# Altium schematic sheet Connector.SchDoc
size A3; SheetNumber: 4; SheetTotal: 5
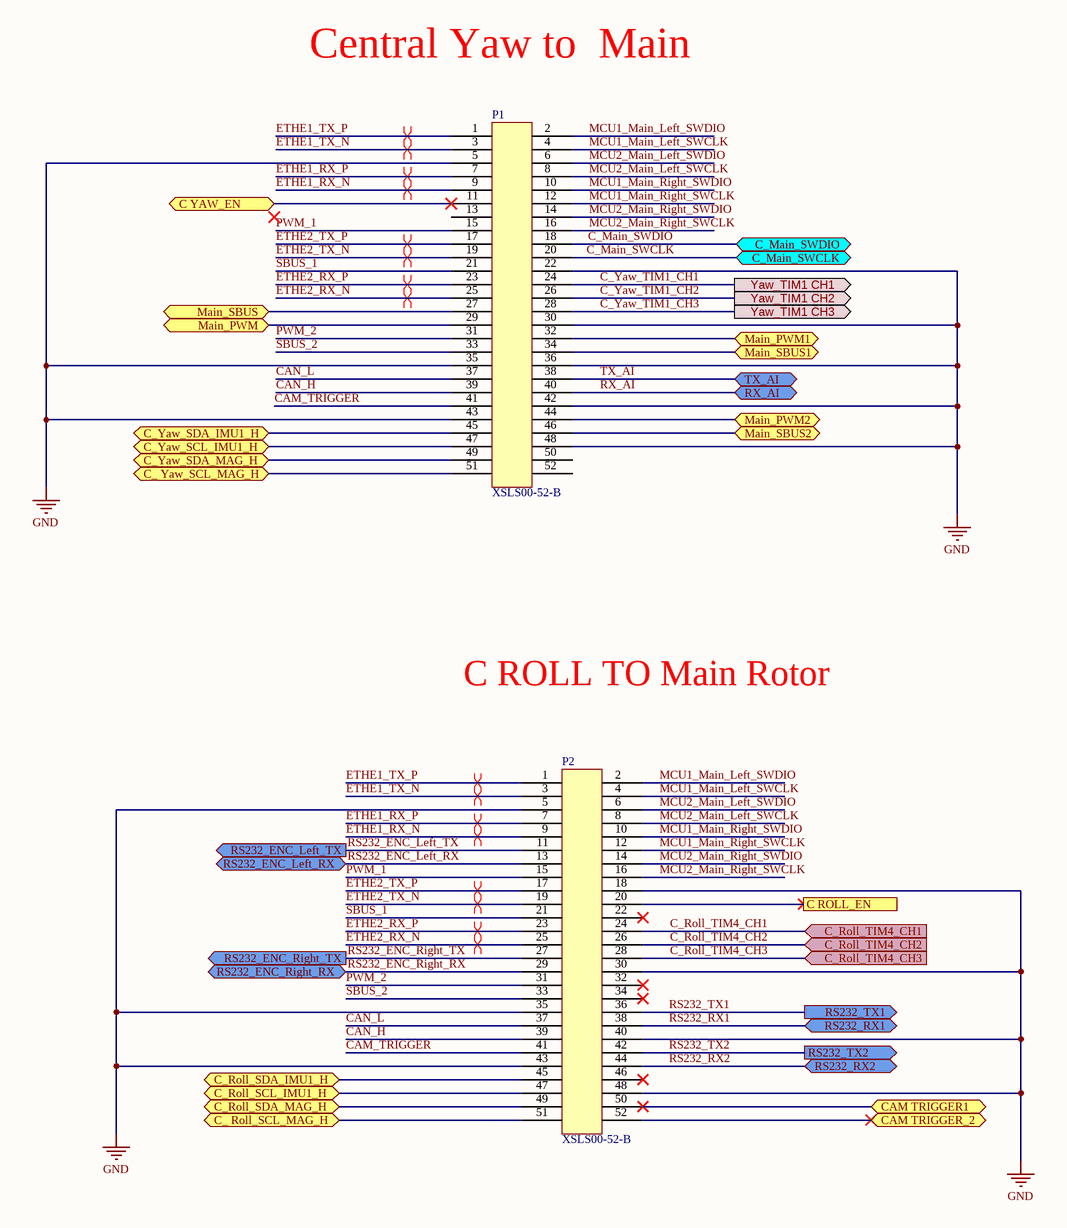
[diagram p0: Connector.SchDoc]

## Parts
P1  XSLS00-52-B  [XSXL52]
P2  XSLS00-52-B  [XSXL52]

## Ports
C ROLL_EN, C YAW_EN (bidir), C_ Roll_SCL_MAG_H (bidir), C_ Yaw_SCL_MAG_H (bidir), C_Main_SWCLK (bidir), C_Main_SWDIO (bidir), C_Roll_SCL_IMU1_H (bidir), C_Roll_SDA_IMU1_H (bidir), C_Roll_SDA_MAG_H (bidir), C_Roll_TIM4_CH1 (in), C_Roll_TIM4_CH2 (in), C_Roll_TIM4_CH3 (in), C_Yaw_SCL_IMU1_H (bidir), C_Yaw_SDA_IMU1_H (bidir), C_Yaw_SDA_MAG_H (bidir), CAM TRIGGER1 (bidir), CAM TRIGGER_2 (bidir), Main_PWM1 (bidir), Main_PWM2 (bidir), Main_PWM (bidir), Main_SBUS1 (bidir), Main_SBUS2 (bidir), Main_SBUS (bidir), RS232_ENC_Left_RX (bidir), RS232_ENC_Left_TX (out), RS232_ENC_Right_RX (bidir), RS232_ENC_Right_TX (out), RS232_RX1 (bidir), RS232_RX2 (bidir), RS232_TX1 (out), RS232_TX2 (out), RX_AI (bidir), TX_AI (bidir), Yaw_TIM1 CH1 (out), Yaw_TIM1 CH2 (out), Yaw_TIM1 CH3 (out)

## Nets
GND: P1.5 P1.22 P1.30 P1.35 P1.36 P1.42 P1.43 P1.48 P2.5 P2.18 P2.30 P2.35 P2.40 P2.43 P2.48
C ROLL_EN: P2.20 ; port C ROLL_EN
C YAW_EN: P1.11 ; port C YAW_EN
C_ Roll_SCL_MAG_H: P2.51 ; port C_ Roll_SCL_MAG_H
C_ Yaw_SCL_MAG_H: P1.51 ; port C_ Yaw_SCL_MAG_H
C_Main_SWCLK: P1.20 ; port C_Main_SWCLK
C_Main_SWDIO: P1.18 ; port C_Main_SWDIO
C_Roll_SCL_IMU1_H: P2.47 ; port C_Roll_SCL_IMU1_H
C_Roll_SDA_IMU1_H: P2.45 ; port C_Roll_SDA_IMU1_H
C_Roll_SDA_MAG_H: P2.49 ; port C_Roll_SDA_MAG_H
C_Roll_TIM4_CH1: P2.24 ; port C_Roll_TIM4_CH1
C_Roll_TIM4_CH2: P2.26 ; port C_Roll_TIM4_CH2
C_Roll_TIM4_CH3: P2.28 ; port C_Roll_TIM4_CH3
C_Yaw_SCL_IMU1_H: P1.47 ; port C_Yaw_SCL_IMU1_H
C_Yaw_SDA_IMU1_H: P1.45 ; port C_Yaw_SDA_IMU1_H
C_Yaw_SDA_MAG_H: P1.49 ; port C_Yaw_SDA_MAG_H
C_Yaw_TIM1_CH1: P1.24 ; port Yaw_TIM1 CH1
C_Yaw_TIM1_CH2: P1.26 ; port Yaw_TIM1 CH2
C_Yaw_TIM1_CH3: P1.28 ; port Yaw_TIM1 CH3
CAM TRIGGER1: P2.50 ; port CAM TRIGGER1
CAM TRIGGER_2: P2.52 ; port CAM TRIGGER_2
CAM_TRIGGER: P1.41 P2.41
CAN_H: P1.39 P2.39
CAN_L: P1.37 P2.37
ETHE1_RX_N: P1.9 P2.9
ETHE1_RX_P: P1.7 P2.7
ETHE1_TX_N: P1.3 P2.3
ETHE1_TX_P: P1.1 P2.1
ETHE2_RX_N: P1.25 P2.25
ETHE2_RX_P: P1.23 P2.23
ETHE2_TX_N: P1.19 P2.19
ETHE2_TX_P: P1.17 P2.17
Main_PWM: P1.29 ; port Main_PWM
Main_PWM1: P1.32 ; port Main_PWM1
Main_PWM2: P1.44 ; port Main_PWM2
Main_SBUS: P1.27 ; port Main_SBUS
Main_SBUS1: P1.34 ; port Main_SBUS1
Main_SBUS2: P1.46 ; port Main_SBUS2
MCU1_Main_Left_SWCLK: P1.4 P2.4
MCU1_Main_Left_SWDIO: P1.2 P2.2
MCU1_Main_Right_SWCLK: P1.12 P2.12
MCU1_Main_Right_SWDIO: P1.10 P2.10
MCU2_Main_Left_SWCLK: P1.8 P2.8
MCU2_Main_Left_SWDIO: P1.6 P2.6
MCU2_Main_Right_SWCLK: P1.16 P2.16
MCU2_Main_Right_SWDIO: P1.14 P2.14
PWM_1: P1.15 P2.15
PWM_2: P1.31 P2.31
RS232_ENC_Left_RX: P2.13 ; port RS232_ENC_Left_RX
RS232_ENC_Left_TX: P2.11 ; port RS232_ENC_Left_TX
RS232_ENC_Right_RX: P2.29 ; port RS232_ENC_Right_RX
RS232_ENC_Right_TX: P2.27 ; port RS232_ENC_Right_TX
RS232_RX1: P2.38 ; port RS232_RX1
RS232_RX2: P2.44 ; port RS232_RX2
RS232_TX1: P2.36 ; port RS232_TX1
RS232_TX2: P2.42 ; port RS232_TX2
RX_AI: P1.40 ; port RX_AI
SBUS_1: P1.21 P2.21
SBUS_2: P1.33 P2.33
TX_AI: P1.38 ; port TX_AI

Not connected (* = marked no-connect by the designer): P1 13 50 52; P2 22* 32* 34* 46*

## Layout directives
differential pair: ETHE1_RX_N, ETHE1_RX_P, ETHE1_TX_N, ETHE1_TX_P, ETHE2_RX_N, ETHE2_RX_P, ETHE2_TX_N, ETHE2_TX_P

## Notes on the sheet
- Central Yaw to  Main
- C ROLL TO Main Rotor